# Altium schematic sheet ADC模块.SchDoc
size A3
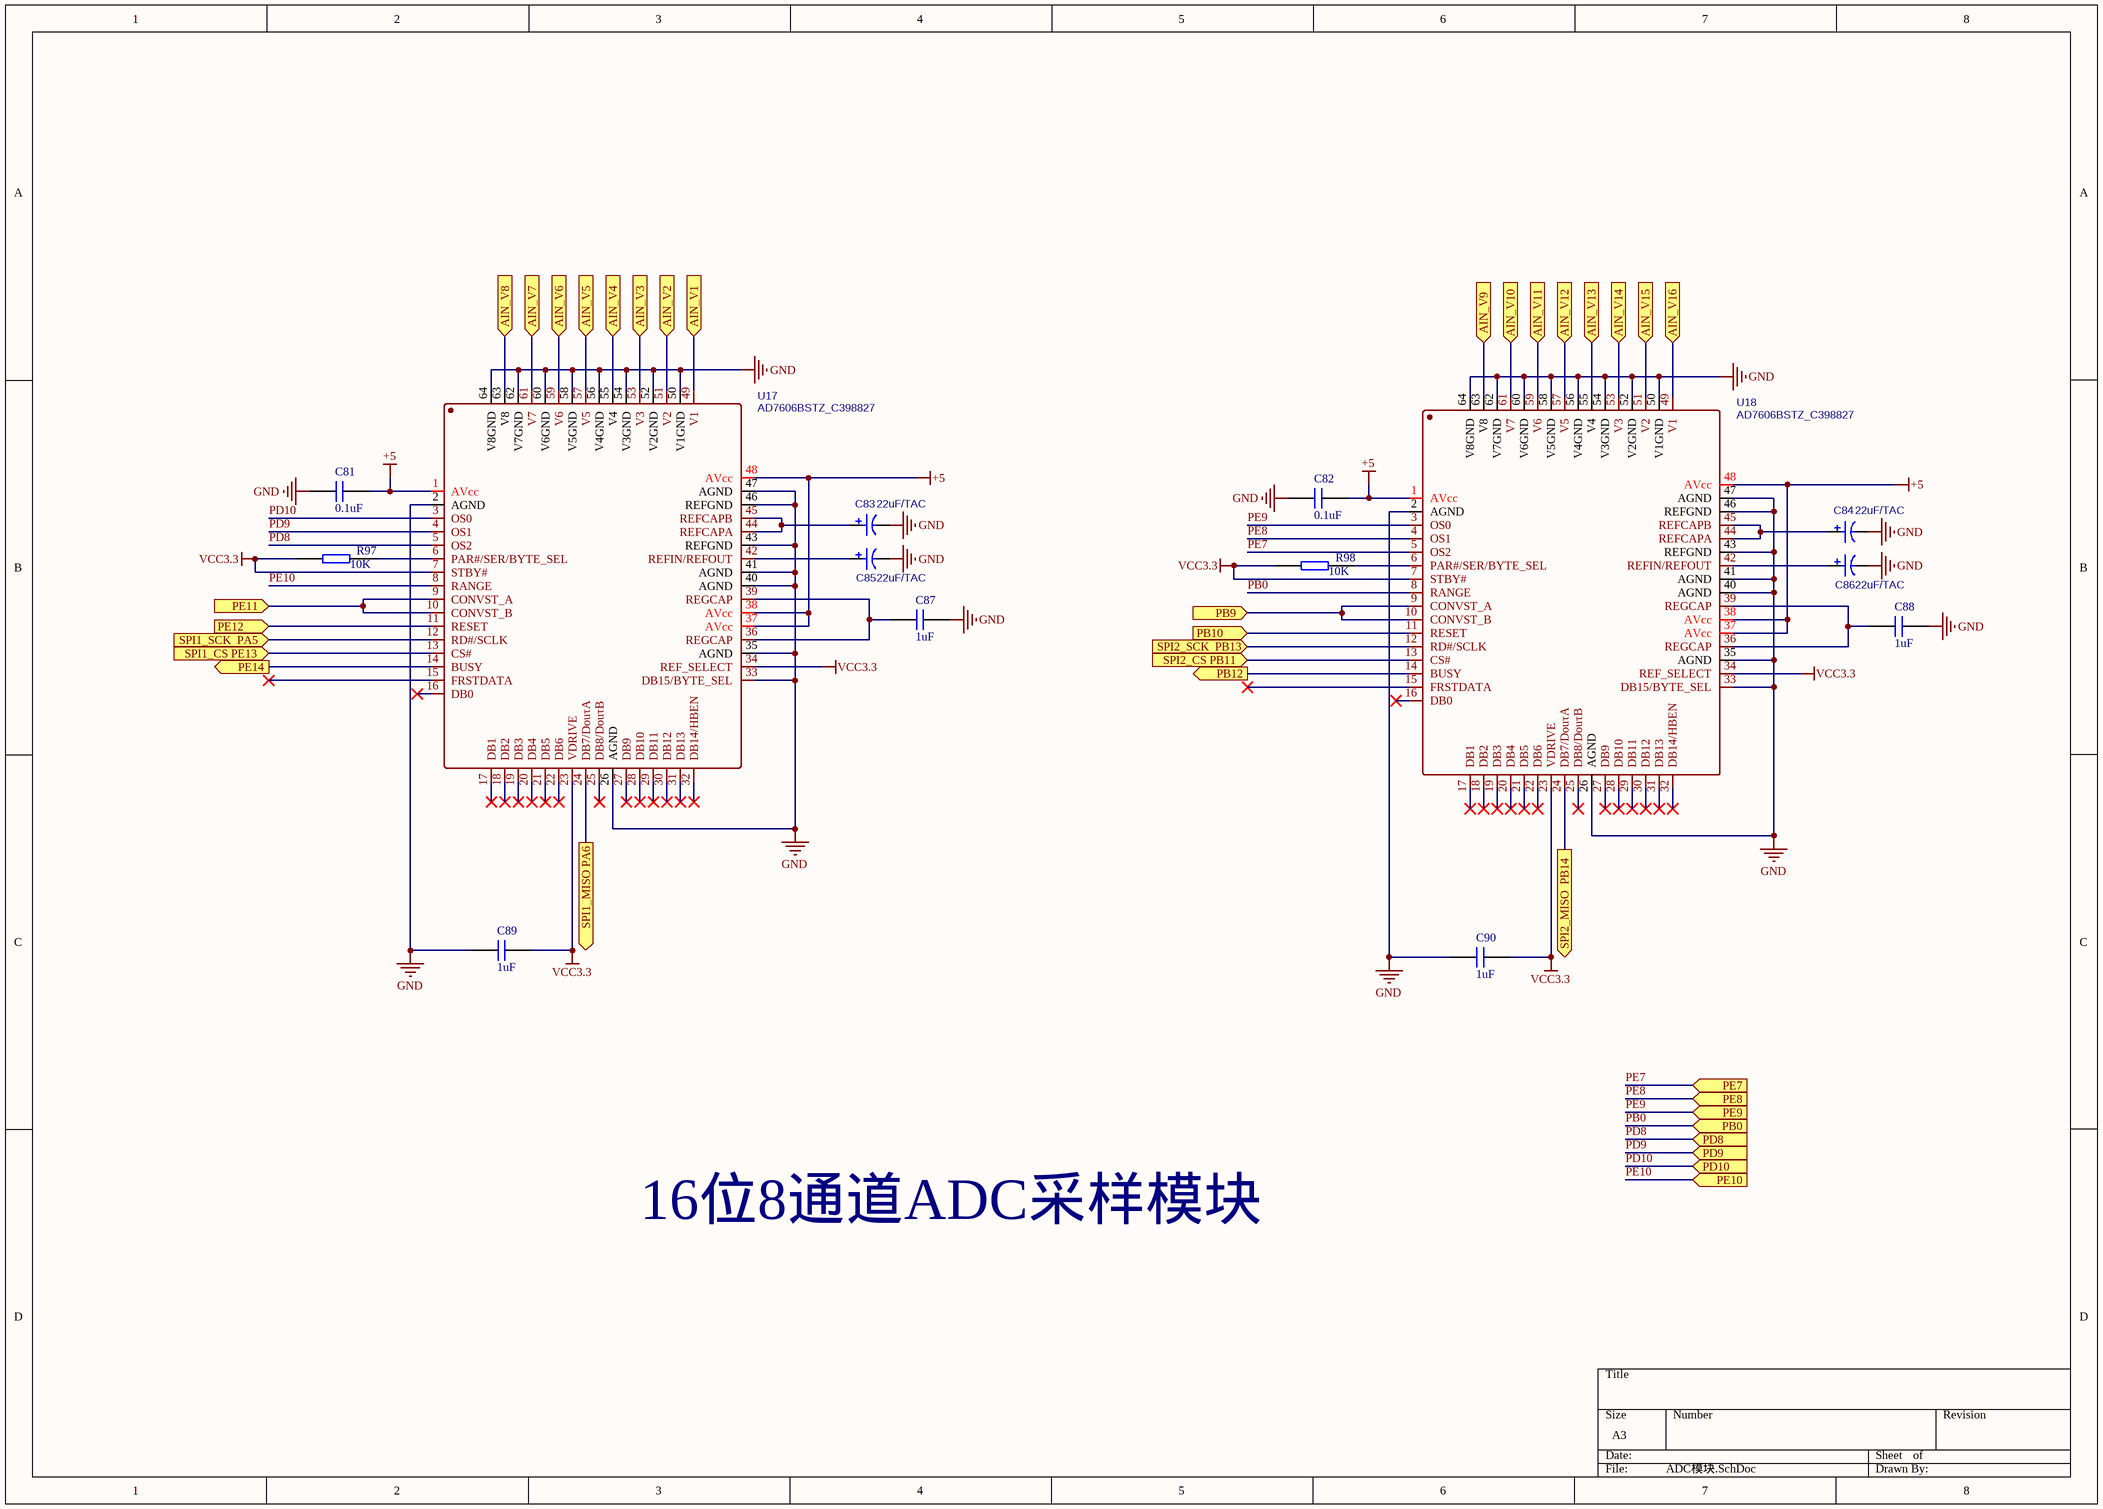
[diagram p0: ADC模块.SchDoc]

## Parts
C81  0.1uF  [0805C]
C82  0.1uF  [0805C]
C83  22uF/TAC  [CASE-C_6032]
C84  22uF/TAC  [CASE-C_6032]
C85  22uF/TAC  [CASE-C_6032]
C86  22uF/TAC  [CASE-C_6032]
C87  1uF  [0805C]
C88  1uF  [0805C]
C89  1uF  [0805C]
C90  1uF  [0805C]
R97  10K  [0603R]
R98  10K  [0603R]
U17  AD7606BSTZ_C398827  [LQFP-64]
U18  AD7606BSTZ_C398827  [LQFP-64]

## Ports
AIN_V1 (in), AIN_V2 (in), AIN_V3 (in), AIN_V4 (in), AIN_V5 (in), AIN_V6 (in), AIN_V7 (in), AIN_V8 (in), AIN_V9 (in), AIN_V10 (in), AIN_V11 (in), AIN_V12 (in), AIN_V13 (in), AIN_V14 (in), AIN_V15 (in), AIN_V16 (in), PB0 (in), PB9 (in), PB10 (in), PB12 (out), PD8 (in), PD9 (in), PD10 (in), PE7 (in), PE8 (in), PE9 (in), PE10 (in), PE11 (in), PE12 (in), PE14 (out), SPI1_CS PE13 (in), SPI1_MISO PA6 (out), SPI1_SCK  PA5 (in), SPI2_CS PB11 (in), SPI2_MISO  PB14 (out), SPI2_SCK  PB13 (in)

## Nets
+5: C81.2 C82.2 U17.1(AVcc) U17.37(AVcc) U17.38(AVcc) U17.48(AVcc) U18.1(AVcc) U18.37(AVcc) U18.38(AVcc) U18.48(AVcc)
GND: C81.1 C82.1 C83.2 C84.2 C85.2 C86.2 C87.2 C88.2 C89.1 C90.1 U17.2(AGND) U17.26(AGND) U17.33(DB15/BYTE_SEL) U17.35(AGND) U17.40(AGND) U17.41(AGND) U17.43(REFGND) U17.46(REFGND) U17.47(AGND) U17.50(V1GND) U17.52(V2GND) U17.54(V3GND) U17.56(V4GND) U17.58(V5GND) U17.60(V6GND) U17.62(V7GND) U17.64(V8GND) U18.2(AGND) U18.26(AGND) U18.33(DB15/BYTE_SEL) U18.35(AGND) U18.40(AGND) U18.41(AGND) U18.43(REFGND) U18.46(REFGND) U18.47(AGND) U18.50(V1GND) U18.52(V2GND) U18.54(V3GND) U18.56(V4GND) U18.58(V5GND) U18.60(V6GND) U18.62(V7GND) U18.64(V8GND)
VCC3.3: C89.2 C90.2 R97.1 R98.1 U17.7(STBY#) U17.23(VDRIVE) U17.34(REF_SELECT) U18.7(STBY#) U18.23(VDRIVE) U18.34(REF_SELECT)
AIN_V1: U17.49(V1) ; port AIN_V1
AIN_V2: U17.51(V2) ; port AIN_V2
AIN_V3: U17.53(V3) ; port AIN_V3
AIN_V4: U17.55(V4) ; port AIN_V4
AIN_V5: U17.57(V5) ; port AIN_V5
AIN_V6: U17.59(V6) ; port AIN_V6
AIN_V7: U17.61(V7) ; port AIN_V7
AIN_V8: U17.63(V8) ; port AIN_V8
AIN_V9: U18.63(V8) ; port AIN_V9
AIN_V10: U18.61(V7) ; port AIN_V10
AIN_V11: U18.59(V6) ; port AIN_V11
AIN_V12: U18.57(V5) ; port AIN_V12
AIN_V13: U18.55(V4) ; port AIN_V13
AIN_V14: U18.53(V3) ; port AIN_V14
AIN_V15: U18.51(V2) ; port AIN_V15
AIN_V16: U18.49(V1) ; port AIN_V16
PB0: U18.8(RANGE) ; port PB0
PB9: U18.9(CONVST_A) U18.10(CONVST_B) ; port PB9
PB10: U18.11(RESET) ; port PB10
PB12: U18.14(BUSY) ; port PB12
PD8: U17.5(OS2) ; port PD8
PD9: U17.4(OS1) ; port PD9
PD10: U17.3(OS0) ; port PD10
PE7: U18.5(OS2) ; port PE7
PE8: U18.4(OS1) ; port PE8
PE9: U18.3(OS0) ; port PE9
PE10: U17.8(RANGE) ; port PE10
PE11: U17.9(CONVST_A) U17.10(CONVST_B) ; port PE11
PE12: U17.11(RESET) ; port PE12
PE14: U17.14(BUSY) ; port PE14
SPI1_CS PE13: U17.13(CS#) ; port SPI1_CS PE13
SPI1_MISO PA6: U17.24(DB7/DouτA) ; port SPI1_MISO PA6
SPI1_SCK  PA5: U17.12(RD#/SCLK) ; port SPI1_SCK  PA5
SPI2_CS PB11: U18.13(CS#) ; port SPI2_CS PB11
SPI2_MISO  PB14: U18.24(DB7/DouτA) ; port SPI2_MISO  PB14
SPI2_SCK  PB13: U18.12(RD#/SCLK) ; port SPI2_SCK  PB13
NetC83_1: C83.1 U17.44(REFCAPA) U17.45(REFCAPB)
NetC84_1: C84.1 U18.44(REFCAPA) U18.45(REFCAPB)
NetC85_1: C85.1 U17.42(REFIN/REFOUT)
NetC86_1: C86.1 U18.42(REFIN/REFOUT)
NetC87_1: C87.1 U17.36(REGCAP) U17.39(REGCAP)
NetC88_1: C88.1 U18.36(REGCAP) U18.39(REGCAP)
NetR97_2: R97.2 U17.6(PAR#/SER/BYTE_SEL)
NetR98_2: R98.2 U18.6(PAR#/SER/BYTE_SEL)

Not connected (* = marked no-connect by the designer): U17 15(FRSTDATA)* 16(DB0)* 17(DB1)* 18(DB2)* 19(DB3)* 20(DB4)* 21(DB5)* 22(DB6)* 25(DB8/DouτB)* 27(DB9)* 28(DB10)* 29(DB11)* 30(DB12)* 31(DB13)* 32(DB14/HBEN)*; U18 15(FRSTDATA)* 16(DB0)* 17(DB1)* 18(DB2)* 19(DB3)* 20(DB4)* 21(DB5)* 22(DB6)* 25(DB8/DouτB)* 27(DB9)* 28(DB10)* 29(DB11)* 30(DB12)* 31(DB13)* 32(DB14/HBEN)*

## Notes on the sheet
- 16位8通道ADC采样模块
- Title
- Size:
- Date:
- A3
- Number:
- Time:
- Revision:
- Sheet
- of
- File:

## Library data of the parts
C81 C82 C87-C90 = CAP: 普通电容
C83-C86 = 10uF: 极性电解电容; BOM_Manufacturer: ValuePro; BOM_Manufacturer Part: Non - polar electrolytic capacitors10uf 100v; nameAlias: Capacitance; BOM_Supplier: LCSC; BOM_Supplier Part: C56706; BOM_JLCPCB Part Class: Extended Part; spicePre: C; spiceSymbolName: Non - polar electrolytic capacitors10uf 100v
R97 R98 = RES: 电阻模型
U17 U18 = AD7606BSTZ_C398827: 16位8路通道ADC; BOM_Manufacturer: Analog Devices; Contributor: LCSC; BOM_Supplier: LCSC; BOM_Supplier Part: C398827; BOM_Manufacturer Part: AD7606BSTZ; BOM_JLCPCB Part Class: Extended Part; spicePre: U; spiceSymbolName: AD7606BSTZ_C398827